# Altium project Camera.PrjPCB
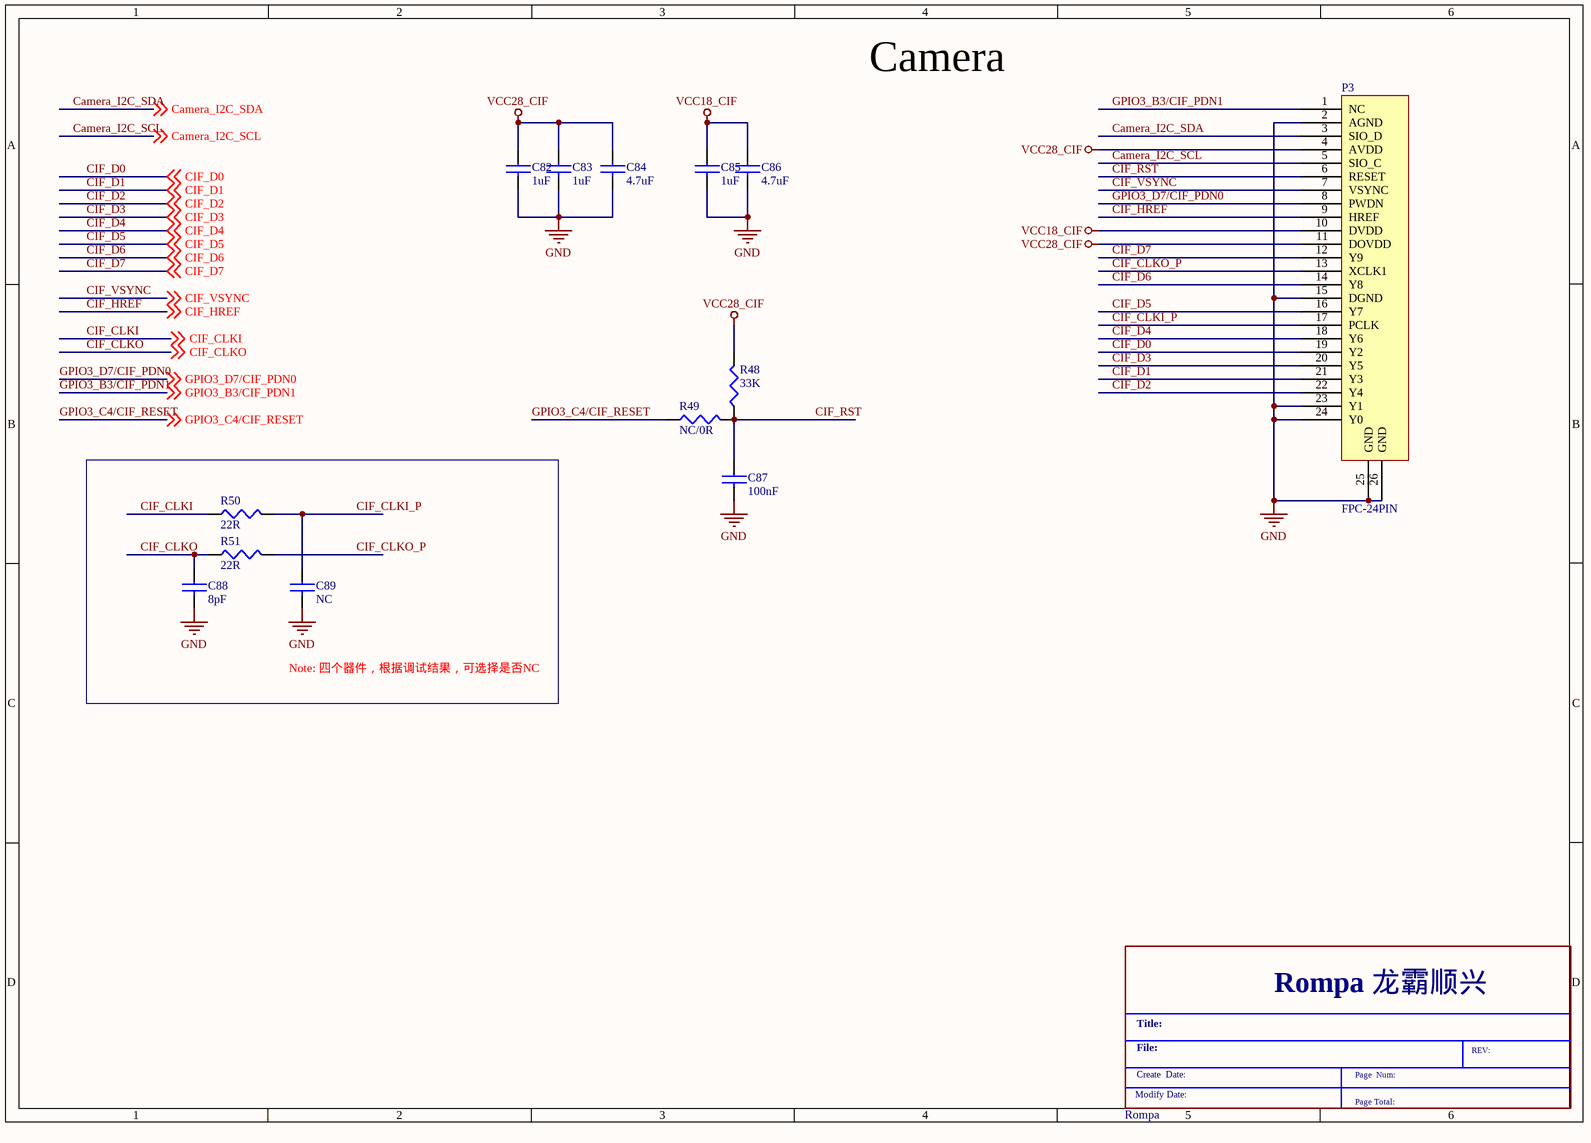
[diagram p0: Option_camera.SchDoc]
1 sheet, 14 parts. Net scope: global (net labels, ports and power ports of the same name join across sheets).

## Sheet Option_camera.SchDoc
size 297 x 209 mm

### Parts
*  Rompa  (graphical)
C82  1uF  [C0402]
C83  1uF  [C0402]
C84  4.7uF  [C0603]
C85  1uF  [C0402]
C86  4.7uF  [C0603]
C87  100nF  [C0402]
C88  8pF  [C0402]
C89  NC  [C0402]
P3  FPC-24PIN
R48  33K  [R0402]
R49  NC/0R  [R0402]
R50  22R  [R0402]
R51  22R  [R0402]

### Blocks framed on the sheet
Note: 四个器件，根据调试结果，可选择是否NC: C88 C89 R50 R51

### Nets
GND: C82.2 C83.2 C84.2 C85.2 C86.2 C87.2 C88.2 C89.2 P3.2(AGND) P3.15(DGND) P3.23(Y1) P3.24(Y0) P3.25(GND) P3.26(GND)
VCC18_CIF: C85.1 C86.1 P3.10(DVDD)
VCC28_CIF: C82.1 C83.1 C84.1 P3.4(AVDD) P3.11(DOVDD) R48.2
Camera_I2C_SCL: P3.5(SIO_C) ; off-sheet Camera_I2C_SCL
Camera_I2C_SDA: P3.3(SIO_D) ; off-sheet Camera_I2C_SDA
CIF_CLKI: R50.1 ; off-sheet CIF_CLKI
CIF_CLKI_P: C89.1 P3.17(PCLK) R50.2
CIF_CLKO: C88.1 R51.1 ; off-sheet CIF_CLKO
CIF_CLKO_P: P3.13(XCLK1) R51.2
CIF_D0: P3.19(Y2) ; off-sheet CIF_D0
CIF_D1: P3.21(Y3) ; off-sheet CIF_D1
CIF_D2: P3.22(Y4) ; off-sheet CIF_D2
CIF_D3: P3.20(Y5) ; off-sheet CIF_D3
CIF_D4: P3.18(Y6) ; off-sheet CIF_D4
CIF_D5: P3.16(Y7) ; off-sheet CIF_D5
CIF_D6: P3.14(Y8) ; off-sheet CIF_D6
CIF_D7: P3.12(Y9) ; off-sheet CIF_D7
CIF_HREF: P3.9(HREF) ; off-sheet CIF_HREF
CIF_RST: C87.1 P3.6(RESET) R48.1 R49.2
CIF_VSYNC: P3.7(VSYNC) ; off-sheet CIF_VSYNC
GPIO3_B3/CIF_PDN1: P3.1(NC) ; off-sheet GPIO3_B3/CIF_PDN1
GPIO3_C4/CIF_RESET: R49.1 ; off-sheet GPIO3_C4/CIF_RESET
GPIO3_D7/CIF_PDN0: P3.8(PWDN) ; off-sheet GPIO3_D7/CIF_PDN0

### Notes on the sheet
- Camera
- (in symbol Rompa) Rompa 龙霸顺兴; Title:; File:; REV:; Create  Date:; Page  Num:; Modify Date:; Page Total:

### Library data of the parts
C82 C83 C85 C87 C89 = CAP NP
C84 C86 = CAP NP_Dup1
C88 = CAP NP: 50V
P3 = FPC_24PIN: cif 24pin footprint
R48-R51 = RESISTOR